# Altium project DC_Motor_Breakout.PrjPcb
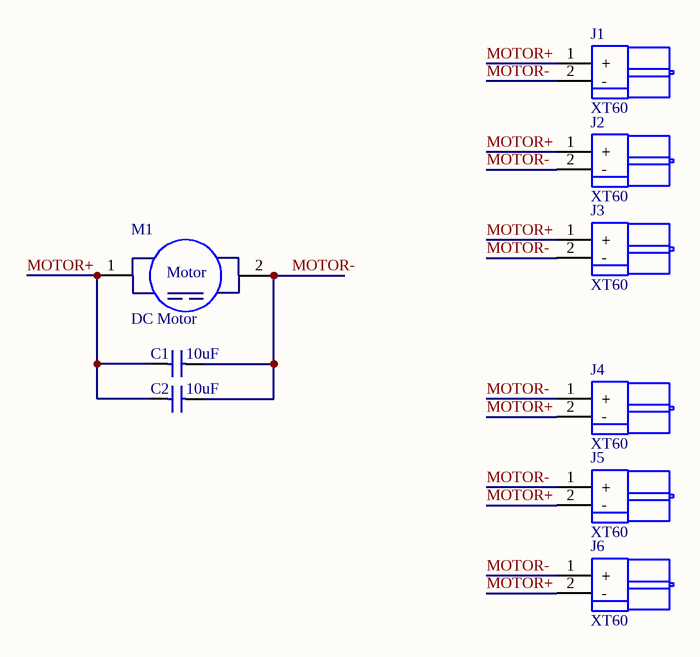
[diagram p0: DC_Motor_Breakout.SchDoc]
1 sheet, 9 parts. Net scope: global (net labels, ports and power ports of the same name join across sheets).
Board files: DC_Motor_Breakout.PcbDoc, DC_Motor_Breakout_Panel.PcbDoc

## Sheet DC_Motor_Breakout.SchDoc
size A

### Parts
C1  value 10uF  [1210_Capacitor]  (hidden comment: C_1210_10uF)
C2  value 10uF  [1210_Capacitor]  (hidden comment: C_1210_10uF)
J1  XT60  [J_XT60_SMD_RA_Male]
J2  XT60  [J_XT60_SMD_RA_Male]
J3  XT60  [J_XT60_SMD_RA_Male]
J4  XT60  [J_XT60_SMD_RA_Male]
J5  XT60  [J_XT60_SMD_RA_Male]
J6  XT60  [J_XT60_SMD_RA_Male]
M1  DC Motor  [Motor_DC_36mm]

### Nets
MOTOR+: C1.2 C2.2 J1.1(+) J2.1(+) J3.1(+) J4.2(-) J5.2(-) J6.2(-) M1.1
MOTOR-: C1.1 C2.1 J1.2(-) J2.2(-) J3.2(-) J4.1(+) J5.1(+) J6.1(+) M1.2

### Notes on the sheet
- (in symbol M_DC_Motor) Motor

### Library data of the parts
C1 C2 = C_1210_10uF: CAP CER 10UF 50V 10% X5R 1210; Manufacturer: Taiyo Yuden; Manufacturer PN: UMK325BJ106KM-T; SVP Creator: Matt Rogge; Package: 1210; Supplier 1: Digi-Key; Supplier Part Number 1: 587-2247-1-ND
J1-J6 = J_XT60: 60 Amp XT60 Connector
M1 = M_DC_Motor: 36mm DC Motor